# EAGLE design power_backup (EAGLE 6.5.0)
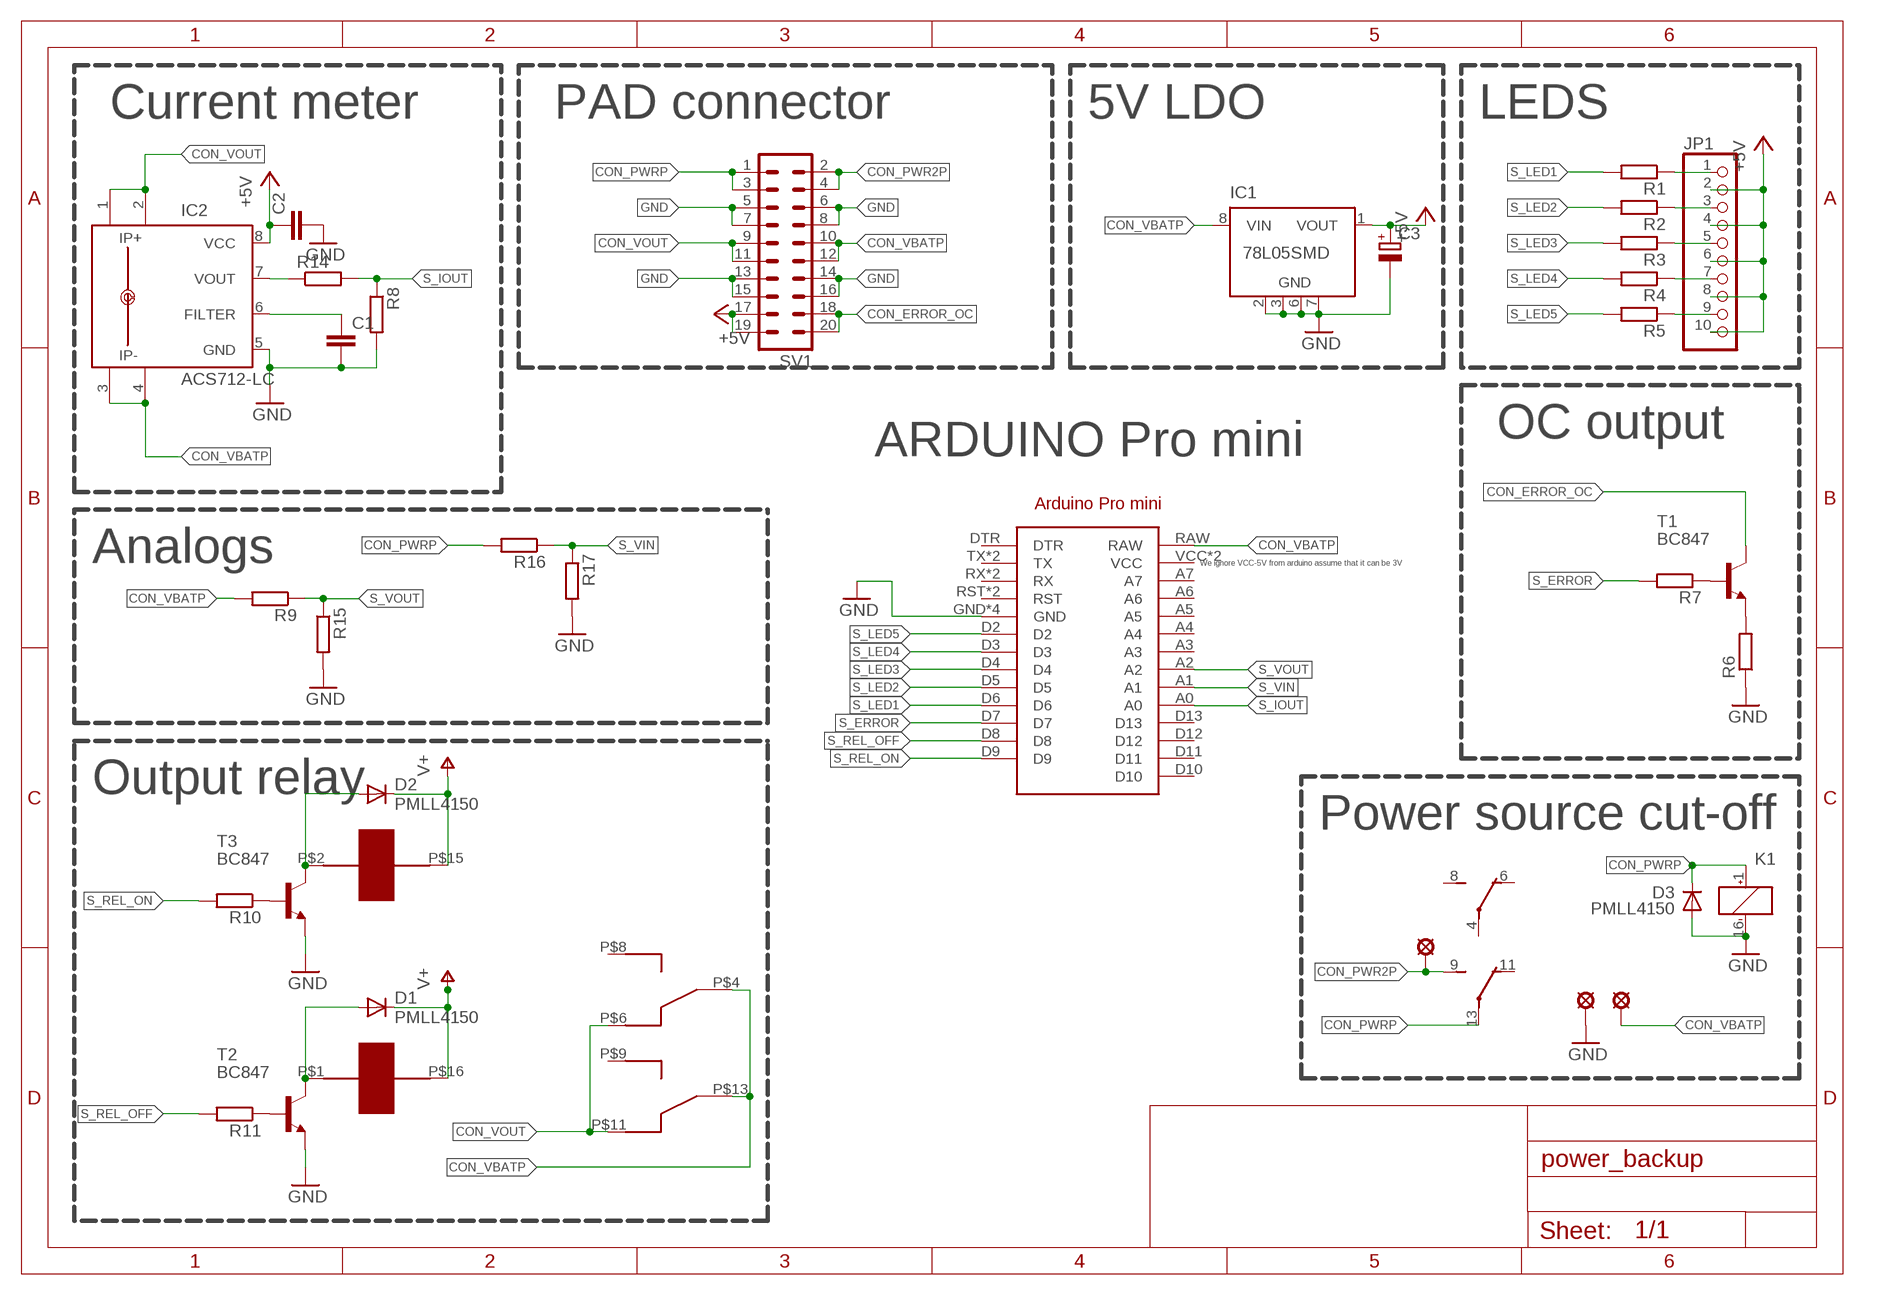
[diagram p0: schematic, sheet 1]

## Parts
ARDUINO1  ARDUINO_PRO_MINI  [ARDUINO_PRO_MINI]
C1  C-EUC0805  [C0805]
C2  C-EUC0805  [C0805]
C3  CPOL-EUSMCC  [SMC_C]
D1  PMLL4150  [SOD80C]
D2  PMLL4150  [SOD80C]
D3  PMLL4150  [SOD80C]
IC1  78L05SMD  [SO08]
IC2  ACS712-LC  [SOIC8]
JP1  PINHD-1X10  [1X10]
K1  DS2Y-S-DC48V  [DS2Y]
LSP1  LSP10  [LSP10]
LSP2  LSP10  [LSP10]
LSP3  LSP10  [LSP10]
R1  R-EU_M0805  [M0805]
R2  R-EU_M0805  [M0805]
R3  R-EU_M0805  [M0805]
R4  R-EU_M0805  [M0805]
R5  R-EU_M0805  [M0805]
R6  R-EU_M0805  [M0805]
R7  R-EU_M0805  [M0805]
R8  R-EU_M0805  [M0805]
R9  R-EU_M0805  [M0805]
R10  R-EU_M0805  [M0805]
R11  R-EU_M0805  [M0805]
R14  R-EU_M0805  [M0805]
R15  R-EU_M0805  [M0805]
R16  R-EU_M0805  [M0805]
R17  R-EU_M0805  [M0805]
SV1  MA10-2  [MA10-2]
T1  BC847  [SOT23]
T2  BC847  [SOT23]
T3  BC847  [SOT23]
U$1  HFD2/003  [RELAY]

## Nets
+5V: C2.1 C3.+ IC1.1(VOUT) IC2.8(VCC) JP1.2 JP1.4 JP1.6 JP1.8 JP1.10 SV1.17 SV1.19
CON_ERROR_OC: SV1.18 SV1.20 T1.3(C)
CON_PWR2P: K1.9(3:S) LSP1.MP SV1.2 SV1.4
CON_PWRP: D3.C K1.1(1:+) K1.13(3:P) R16.2 SV1.1 SV1.3
CON_VBATP: ARDUINO1.RAW IC1.8(VIN) IC2.3(IP-) IC2.4(IP-1) LSP2.MP R9.2 SV1.10 SV1.12 U$1.P$4(MID) U$1.P$13(MID)
CON_VOUT: IC2.1(IP+) IC2.2(IP+1) SV1.9 SV1.11 U$1.P$6(NC) U$1.P$11(NC)
GND: ARDUINO1.GND ARDUINO1.GND@1(GND) ARDUINO1.GND@2(GND) ARDUINO1.GND@3(GND) C1.2 C2.2 C3.- D3.A IC1.2(GND) IC1.3(GND) IC1.6(GND) IC1.7(GND) IC2.5(GND) K1.16(1:-) LSP3.MP R6.1 R8.2 R15.2 R17.2 SV1.5 SV1.6 SV1.7 SV1.8 SV1.13 SV1.14 SV1.15 SV1.16 T2.2(E) T3.2(E)
N$1: JP1.1 R1.1
N$2: JP1.3 R2.1
N$3: JP1.5 R3.1
N$4: JP1.7 R4.1
N$5: JP1.9 R5.1
N$6: D1.A T2.3(C) U$1.P$1
N$7: D2.A T3.3(C) U$1.P$2
N$8: R10.1 T3.1(B)
N$9: R11.1 T2.1(B)
N$12: C1.1 IC2.6(FILTER)
N$13: IC2.7(VOUT) R14.1
N$14: R7.1 T1.1(B)
N$15: R6.2 T1.2(E)
S_ERROR: ARDUINO1.D7 R7.2
S_IOUT: ARDUINO1.A0 R8.1 R14.2
S_LED1: ARDUINO1.D6 R1.2
S_LED2: ARDUINO1.D5 R2.2
S_LED3: ARDUINO1.D4 R3.2
S_LED4: ARDUINO1.D3 R4.2
S_LED5: ARDUINO1.D2 R5.2
S_REL_OFF: ARDUINO1.D8 R11.2
S_REL_ON: ARDUINO1.D9 R10.2
S_VIN: ARDUINO1.A1 R16.1 R17.1
S_VOUT: ARDUINO1.A2 R9.1 R15.1
V+: D1.C D2.C U$1.P$15 U$1.P$16
Unconnected: ARDUINO1.A3 ARDUINO1.A4 ARDUINO1.A5 ARDUINO1.A6 ARDUINO1.A7 ARDUINO1.D10 ARDUINO1.D11 ARDUINO1.D12 ARDUINO1.D13 ARDUINO1.DTR ARDUINO1.RST ARDUINO1.RST@1(RST) ARDUINO1.RX ARDUINO1.RX@1(RX) ARDUINO1.TX ARDUINO1.TX@1(TX) IC1.4(NC) IC1.5(NC) K1.4(2:P) K1.6(2:O) K1.8(2:S) K1.11(3:O) U$1.P$8(NO) U$1.P$9(NO)

## Notes on the sheet
- Current meter | PAD connector | 5V LDO | LEDS
- OC output
- ARDUINO Pro mini
- Analogs | We ignore VCC-5V from arduino assume that it can be 3V
- Output relay
- Power source cut-off

## Power pins joined to a net without a drawn wire
VCC: ARDUINO1.VCC ARDUINO1.VCC@1(VCC)

## Library data of the parts
ARDUINO1 = arduinopromini:ARDUINO_PRO_MINI: For creating Arduino Pro Mini shields
C1 C2 = rcl:C-EU: CAPACITOR, European symbol
C3 = rcl:CPOL-EU: POLARIZED CAPACITOR, European symbol
D1-D3 = diode:PMLL4150: DIODE high speed
IC1 = linear:78L*SMD: Positive VOLTAGE REGULATOR
IC2 = allegro-2:ACS712-LC
JP1 = pinhead:PINHD-1X10: PIN HEADER
K1 = relay:DS2Y-S-DC*: MINIATURE RELAY NAiS Source: http://www.mew-europe.com/.. en_ds_61005_0023.pdf; MPN: DS2Y-S-DC48V; OC_FARNELL: unknown; OC_NEWARK: 13P3267
LSP1-LSP3 = solpad:LSP10: SOLDER PAD drill 1.0 mm, distributor Buerklin, 12H555
R1-R11 R14-R17 = rcl:R-EU_: RESISTOR, European symbol
SV1 = con-lstb:MA10-2: PIN HEADER; OC_FARNELL: unknown; OC_NEWARK: unknown
T1-T3 = transistor:BC847: NPN TRANSISTOR
U$1 = relay_hfd2:HFD2/003

## Board
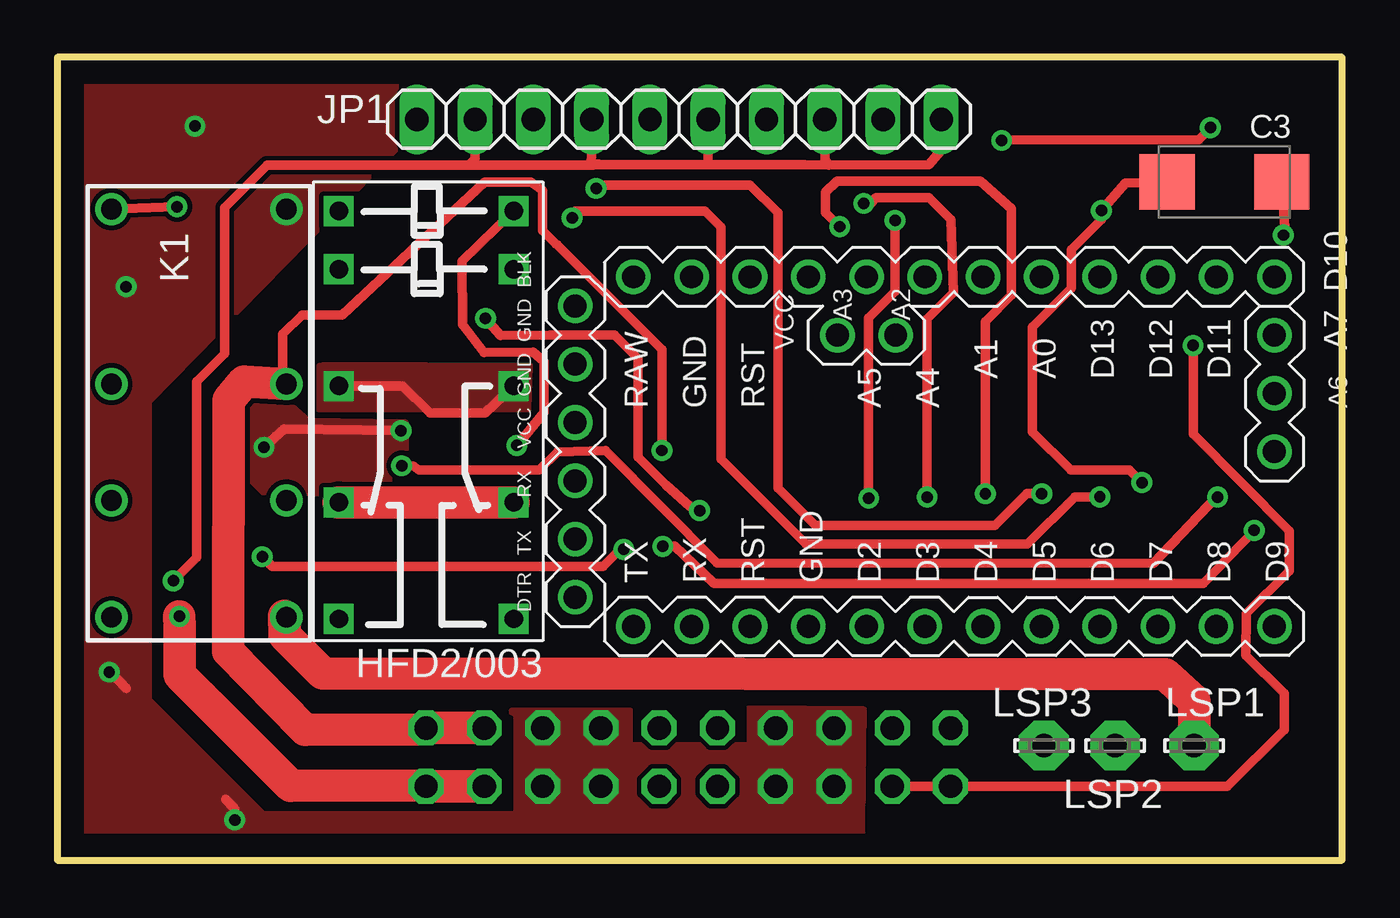
[diagram p1: board, top side]
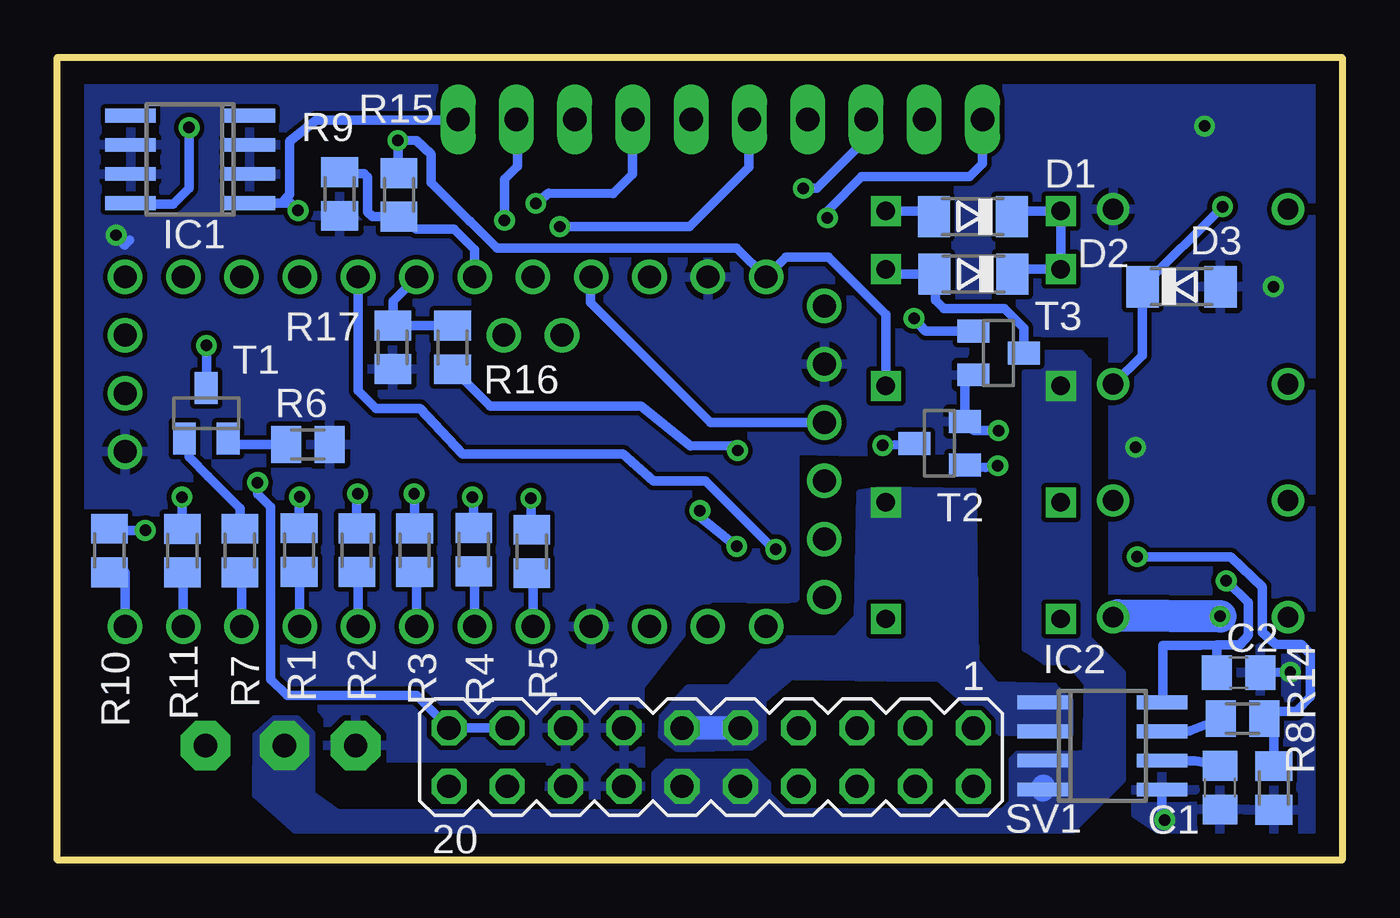
[diagram p2: board, bottom side, seen from below]

Size 56 x 35 mm. Coordinates in mm from the lower left corner, seen from the top.
Outline: 0,0 56,0 56,35 0,35 0,0
Copper layers (1*16): Top 0.035mm / dielectric 1.5mm / Bottom 0.035mm
Design rules "default": minimum track width 10mil, minimum drill 24mil, track to track 8mil, track to pad 8mil, pad to pad 8mil, via to via 8mil, smd to smd 8mil, copper to edge 40mil, drill to drill 8mil, minimum pad ring 10mil, minimum via ring 8mil, stop-mask expansion 4mil, vias tented up to drill 0mil, thermal gap 10mil

### Footprints (pad centres in the part's own frame; a part is rotated, then mirrored left to right if it is on the bottom)
ARDUINO_PRO_MINI = drill 1: A0 11.43,-8.89; A1 11.43,-6.35; A2 11.43,-3.81; A3 11.43,-1.27; A4 8.89,-2.54; A5 8.89,0; A6 6.35,-19.05; A7 8.89,-19.05; BLK 10.16,11.43; D2 -3.81,-1.27; D3 -3.81,-3.81; D4 -3.81,-6.35; D5 -3.81,-8.89; D6 -3.81,-11.43; D7 -3.81,-13.97; D8 -3.81,-16.51; D9 -3.81,-19.05; D10 11.43,-19.05; D11 11.43,-16.51; D12 11.43,-13.97; D13 11.43,-11.43; DTR -2.54,11.43; GND -3.81,1.27; GND@1 11.43,6.35; GND@2 7.62,11.43; GND@3 3.81,-19.05; RAW 11.43,8.89; RST 11.43,3.81; RST@1 -3.81,3.81; RX -3.81,6.35; RX@1 2.54,11.43; TX -3.81,8.89; TX@1 0,11.43; VCC 11.43,1.27; VCC@1 5.08,11.43
C0805 = smd 1.3 x 1.5: 1 -0.95,0; 2 0.95,0
SMC_C = smd 2.4 x 2.4: + -2.5,0; - 2.5,0
SOD80C = smd 1.4 x 1.8: A 1.7,0; C -1.7,0
SO08 = smd 0.6 x 2.2: 1 -1.905,-2.6; 2 -0.635,-2.6; 3 0.635,-2.6; 4 1.905,-2.6; 5 1.905,2.6; 6 0.635,2.6; 7 -0.635,2.6; 8 -1.905,2.6
SOIC8 = smd 0.6 x 2.2: 1 -1.905,-2.6; 2 -0.635,-2.6; 3 0.635,-2.6; 4 1.905,-2.6; 5 1.905,2.6; 6 0.635,2.6; 7 -0.635,2.6; 8 -1.905,2.6
1X10 = drill 1.016 long: 1 -11.43,0; 2 -8.89,0; 3 -6.35,0; 4 -3.81,0; 5 -1.27,0; 6 1.27,0; 7 3.81,0; 8 6.35,0; 9 8.89,0; 10 11.43,0
DS2Y = drill 0.9: 1 -8.89,-3.81; 4 -1.27,-3.81; 6 3.81,-3.81; 8 8.89,-3.81; 9 8.89,3.81; 11 3.81,3.81; 13 -1.27,3.81; 16 -8.89,3.81
LSP10 = drill 1.016 pad 2.159 octagon: MP 0,0
M0805 = smd 1.3 x 1.6: 1 -0.95,0; 2 0.95,0
MA10-2 = drill 1.016 octagon: 1 -11.43,-1.27; 2 -11.43,1.27; 3 -8.89,-1.27; 4 -8.89,1.27; 5 -6.35,-1.27; 6 -6.35,1.27; 7 -3.81,-1.27; 8 -3.81,1.27; 9 -1.27,-1.27; 10 -1.27,1.27; 11 1.27,-1.27; 12 1.27,1.27; 13 3.81,-1.27; 14 3.81,1.27; 15 6.35,-1.27; 16 6.35,1.27; 17 8.89,-1.27; 18 8.89,1.27; 19 11.43,-1.27; 20 11.43,1.27
SOT23 = smd 1 x 1.4: 1 -0.95,-1.1; 2 0.95,-1.1; 3 0,1.1
RELAY = drill 0.8 square: P$1 1.27,1.27; P$2 1.27,3.81; P$4 1.27,8.89; P$6 1.27,13.97; P$8 1.27,19.05; P$9 8.89,19.05; P$11 8.89,13.97; P$13 8.89,8.89; P$15 8.89,3.81; P$16 8.89,1.27

### Placement (x,y rotation side)
ARDUINO1  34,14 90 top
C1  5.33,3.16 270 bottom
C2  4.52,8.18 0 bottom
C3  50.87,29.57 0 top
D1  16.1,28.06 180 bottom
D2  16.07,25.55 180 bottom
D3  7,25 0 bottom
IC1  50.21,30.55 90 bottom
IC2  10.45,4.98 270 bottom
JP1  27.1,32.3 0 top
K1  6.17,19.49 270 top
LSP1  49.55,5 0 top
LSP2  46.1,5 0 top
LSP3  43,5 0 top
R1  45.46,13.52 270 bottom
R2  42.95,13.51 270 bottom
R3  40.43,13.51 270 bottom
R4  37.85,13.54 270 bottom
R5  35.32,13.46 270 bottom
R6  45.08,18.12 180 bottom
R7  48.04,13.5 270 bottom
R8  2.98,3.15 270 bottom
R9  41.11,29 90 bottom
R10  53.73,13.5 270 bottom
R11  50.55,13.49 270 bottom
R14  4.34,6.17 0 bottom
R15  43.7,29.04 270 bottom
R16  38.77,22.35 270 bottom
R17  41.38,22.36 270 bottom
SV1  27.5,4.49 180 bottom
T1  49.51,19.48 0 bottom
T2  17.55,18.17 90 bottom
T3  14.98,22.11 270 bottom
U$1  21.16,29.57 180 top

### Tracks (layer width: path | path; a pad name or v marks a point on that pad's centre or on a via)
+5V  (via drill 0.5)
  Top 0.406: 24,30.32 23.26,30.36 23.29,30.82 JP1.4 | 24,30.32 28.34,30.33 | 28.34,30.33 32.58,30.32 33.63,30.31 | 33.63,30.31 37.98,30.32 38.5,30.91 38.5,32.27 JP1.10 | JP1.8 33.45,30.57 33.63,30.31 | JP1.6 28.37,30.72 28.34,30.33 | 17.93,30.3 23.36,30.31 24,30.32 | JP1.2 18.21,30.58 17.93,30.3 | 17.93,30.3 9.15,30.3 7.3,28.45 7.3,22.09 6.07,20.86 6.07,13.2 v5.05,12.18 5.01,12.18 | v47.27,16.46 46.73,17 44.17,17 42.5,18.67 42.5,23.24 44.19,24.93 44.19,26.61 45.51,27.93 v45.51,28.32 46.54,29.52 C3.+
  Bottom 0.406: 5.47,9.38 6.19,9.37 7.8,9.37 7.8,7.06 7.85,7.01 IC2.8 | 5.47,9.38 4.46,9.39 4.1,9.8 4.1,11.23 v5.05,12.18 | IC1.1 46.22,28.64 | 46.22,28.64 45.87,29.01 45.87,31.35 44.73,32.26 38.57,32.26 JP1.10 | SV1.17 SV1.19 40.35,7.18 45.99,7.18 46.7,7.89 46.7,15.4 47.27,15.97 v47.27,16.46 | 46.22,28.64 45.84,28.64 v45.51,28.32 | C2.1 5.47,9.38
CON_ERROR_OC  (via drill 0.5)
  Top 0.406: SV1.18 SV1.20 51,3.22 53.47,5.69 53.47,7.27 51.81,8.93 51.82,10.75 53.69,12.62 53.69,14.35 49.52,18.59 49.52,22.42 v49.5,22.44
  Bottom 0.406: v49.5,22.44 T1.3
CON_PWR2P  (via drill 0.5)
  Top 0.406: 10.16,3.25 13.43,3.25
  Top 1.422: SV1.4 SV1.2 16.02,3.27 10.16,3.25 5.33,8.08 5.33,10.21 v5.32,10.63 | LSP1.MP 49.55,6.94 48.3,8.11 11.56,8.15 9.9,9.8 9.88,10.65 K1.9
  Bottom 1.422: v5.32,10.63 9.78,10.67 K1.9
CON_PWRP  (via drill 0.5)
  Top 0.406: v26.35,17.86 26.35,22.27 21.78,26.84 21.74,26.86 21.15,27.45 21.15,29.18 20.65,29.56 18.62,29.56 12.41,23.77 10.67,23.77 9.83,22.93 9.83,20.88 K1.13 | K1.1 v5.21,28.49
  Top 1.016: 18.68,5.83 SV1.3
  Top 1.422: K1.13 8.15,20.87 7.46,20.05 7.45,9.1 10.81,5.69 16.01,5.7 SV1.1 SV1.3
  Bottom 0.406: R16.2 38.73,21.4 37.14,19.81 30.57,19.81 28.4,18.05 26.55,18.07 v26.35,17.86 | K1.13 8.7,21.99 D3.C v5.21,28.49
CON_VBATP  (via drill 0.5)
  Top 0.406: U$1.P$13 15.05,20.68 16.24,19.49 18.64,19.49 U$1.P$4 | v41.16,31.38 49.76,31.41 v50.26,31.94
  Bottom 0.406: U$1.P$4 19.89,23.79 22.39,26.29 24.24,26.3 ARDUINO1.RAW 26.4,26.69 36.83,26.69 38,27.86 38.03,27.86 39.7,29.53 39.7,30.79 40.34,31.36 v41.16,31.38 41.17,31.29 R9.2 41.17,30.05 | 51.95,28.66 IC1.8 52.77,28.6 50.96,28.6 50.26,29.3 v50.26,31.94
  Bottom 1.016: 13.03,3.23 IC2.4
  pour Top (no thermals): 11.42,21.55 11.4,19.66 20.54,19.66 20.61,21.55 11.67,21.58
  pour Bottom (no thermals): 11.07,21.8 11.07,9.7 9.56,8.19 9.56,3.49 12.22,0.83 44.91,0.63 47.38,2.82 47.36,5.47 46.52,6.2 45.55,6.2 44.9,5.56 44.9,2.91 43.77,2.12 30.34,2.12 29.97,2.43 29.97,3.81 29.42,4.31 25.95,4.3 25.02,3.37 25.02,2.89 24.28,2.15 14.79,2.15 14.4,2.54 14.4,4.4 14.13,4.66 11.79,4.66 11.19,4.71 11.13,7.69 11.93,8.63 12.94,8.61 13.83,9.21 13.83,21.28 12.99,22.12 11.38,22.12 11.03,21.77
CON_VOUT
  Top 1.422: U$1.P$11 U$1.P$6
  Bottom 1.016: SV1.11 SV1.9
  pour Bottom (no thermals): 16.05,16.1 20.13,16.17 21.06,16.03 21.17,10.61 22.07,9.66 24.77,9.67 26.72,7.54 28.53,7.53 29.67,6.25 29.71,5.42 28.96,4.84 25.73,4.92 25.2,5.33 25.2,6.99 24,8 19.85,7.92 17.63,7.93 14.92,5.56 11.83,5.5 11.82,6.93 12.54,7.61 15.1,7.67 15.95,8.69
GND  (via drill 0.5)
  Top 0.406: v9,18 9.88,18.79 v14.98,18.73 | C3.- 53.5,27.57 v53.44,27.25 | v7.73,1.76 7.73,2.25 7.33,2.65 | v2.26,8.2 2.33,8.2 3.01,7.49
  Bottom 0.406: v14.98,18.73 16.06,18.73 T2.2 16.45,20.79 T3.2 | v53.44,27.25 53.06,26.82 52.84,27.04 | IC2.5 7.85,1.88 v7.73,1.76 | C2.2 2.16,8.21 v2.26,8.2
  other vias: 3,25 6,32
  pour Bottom: 0,35 56,35 56.35,-0.49 48.39,-0.39 48.29,5.63 48.29,6.09 47.35,7.03 44.89,7.01 44.2,6.26 44.23,4.45 34.51,4.47 34.56,2.85 30.58,2.82 30.6,7.57 27.57,11.44 24.32,11.39 23.86,11.43 23.86,17.87 18.02,17.74 17,18 17,21 16,23 10,23 10,11 6,8 9,5 9,2 6,0 0,0
  pour Top (no thermals): 19.79,6.45 arc-90 20,6.24 20,2 9,2 4,7 4,20 14.77,31 14.77,34.93 -0.23,34.93 -0.31,-0.11 35.06,-0.01 35.16,6.57 30.16,6.62 30.16,5.01 24.97,5.01 24.97,6.51 19.81,6.51
  pour Top: 8,20 10,20 10.94,19.16 15.17,19.1 15.17,15.9 9,16 8,17
N$1  (via drill 0.5)
  Top 0.406: v45.44,15.84 44.35,15.84 42.29,13.78 32.63,13.78 28.93,17.48 28.93,27.6 28.23,28.3 22.57,28.3 22.27,28 v22.44,28
  Bottom 0.406: R1.1 45.46,15.82 v45.44,15.84 | JP1.1 15.67,30.36 16.24,29.79 20.96,29.79 22.38,28.34 22.39,27.91 v22.44,28
N$2  (via drill 0.5)
  Top 0.406: v42.91,15.98 42.25,15.98 40.86,14.59 33.04,14.59 31.41,16.22 31.41,28.22 30.2,29.43 23.62,29.43 v23.48,29.29
  Bottom 0.406: R2.1 42.95,15.94 v42.91,15.98 | v23.48,29.29 22.89,29.29 20.82,31.36 20.82,32.23 JP1.3
N$3  (via drill 0.5)
  Top 0.406: v40.45,15.98 40.45,23.49 41.59,24.63 41.59,28.41 40.23,29.61 33.98,29.61 33.48,29.13 33.48,28.24 v34.1,27.62
  Bottom 0.406: R3.1 40.43,15.96 v40.45,15.98 | v34.1,27.62 28.44,27.62 25.85,30.21 25.85,32.28 JP1.5
N$4  (via drill 0.5)
  Top 0.406: v37.91,15.83 37.91,23.6 39.06,24.75 38.94,27.92 37.98,28.88 35.69,28.89 35.43,28.63 v35.15,28.63
  Bottom 0.406: R4.1 37.85,15.77 v37.91,15.83 | v35.15,28.63 34.58,29.08 31.78,29.06 30.94,29.9 30.94,32.27 JP1.7
N$5  (via drill 0.5)
  Top 0.406: v35.36,15.78 35.36,23.64 36.51,24.79 v36.51,27.89
  Bottom 0.406: R5.1 35.36,14.41 v35.36,15.78 | v36.51,27.89 36.51,29.68 35.94,30.25 35.94,32.25 JP1.9
N$6  (via drill 0.5)
  Top 0.406: U$1.P$1 17.64,26.11 17.66,23.36 18.6,22.13 20.74,22.15 21.21,21.73 21.22,19.51 v20.03,18.08
  Bottom 0.406: U$1.P$1 18.04,28.3 D1.A | v20.03,18.08 19.09,18.12 T2.3
N$7
  Bottom 0.406: U$1.P$2 19.62,25.55 D2.A 17.73,25.51 17.73,24.42 17.35,24.04 14.73,24.04 13.88,23.19 T3.3
N$8  (via drill 0.5)
  Top 0.406: v18.66,23.62 19.32,22.87 21.45,22.89 24.29,22.89 25.31,21.87 25.31,17.57 26.52,16.36 27.58,15.41 v27.99,15.24 | v26.39,13.68 26.89,13.69 28.62,12.07 49.95,12.07 v52.17,14.38
  Bottom 0.406: 18.42,23.56 v18.66,23.62 18.17,23.06 T3.1 | 53.03,14.42 R10.1 53.66,14.38 v52.17,14.38 | v27.99,15.24 28,14.97 v26.39,13.68
N$9  (via drill 0.5)
  Top 0.406: v50.57,15.83 50.56,15.88 47.76,12.94 28.76,12.95 23.89,17.86 21.8,17.8 21,17 15.76,17 15.51,17.19 v15.01,17.2
  Bottom 0.406: R11.1 50.55,15.81 v50.57,15.83 | v15.01,17.2 15.56,17.13 16.38,17.15 T2.1
N$12
  Bottom 0.406: C1.1 6.27,4.31 6.4,4.33 7.82,4.33 IC2.6
N$13
  Bottom 0.406: 7.83,5.73 IC2.7 6.64,5.63 R14.1
N$14
  Bottom 0.406: R7.1 48.04,15.34 49.42,16.72 49.42,16.73 50.26,17.57 50.26,18.18 T1.1
N$15
  Bottom 0.406: R6.2 48.3,18.12 T1.2
S_ERROR
  Bottom 0.406: ARDUINO1.D7 47.97,12.48 R7.2
S_IOUT  (via drill 0.5)
  Top 0.406: v24.69,13.55 24.53,13.55 23.78,12.8 9.36,12.8 v8.93,13.23
  Bottom 0.406: R8.1 2.98,6.08 | 2.98,6.08 2.95,6.49 | 2.95,6.49 R14.2 | 3,6.29 2.98,6.08 | ARDUINO1.A0 42.89,20.48 42.11,19.7 40.19,19.7 38.34,17.7 31.34,17.7 30.02,16.53 27.75,16.53 24.77,13.55 v24.69,13.55 | v8.93,13.23 4.85,13.23 3.49,11.91 3.49,9.93 2.89,9.4 1.79,9.4 1.38,8.99 1.38,7.11 2,6.49 2.95,6.49
S_LED1
  Bottom 0.406: ARDUINO1.D6 45.43,12.54 R1.2
S_LED2
  Bottom 0.406: ARDUINO1.D5 42.89,12.5 R2.2
S_LED3
  Bottom 0.406: ARDUINO1.D4 40.35,12.48 R3.2
S_LED4
  Bottom 0.406: ARDUINO1.D3 37.81,12.55 R4.2
S_LED5
  Bottom 0.406: ARDUINO1.D2 35.27,12.46 R5.2
S_REL_OFF
  Bottom 0.406: ARDUINO1.D8 50.51,12.5 R11.2
S_REL_ON
  Bottom 0.406: ARDUINO1.D9 53.05,12.54 R10.2
S_VIN
  Bottom 0.406: ARDUINO1.A1 40.35,25.4 41.37,24.38 R17.1 R16.1
S_VOUT
  Bottom 0.406: ARDUINO1.A2 37.81,26.62 38.7,27.51 40.36,27.51 40.94,27.97 41.29,27.89 R9.1 | R9.1 41.02,28.03 | R9.1 42.26,28.05 42.47,28.26 42.47,29.77 42.63,29.93 43.64,29.93 R15.1
V+
  Bottom 0.406: D1.C 14.16,28.3 U$1.P$16 U$1.P$15 14.16,25.76 D2.C
VCC
  Bottom 0.406: ARDUINO1.VCC@1 27.53,19.08 32.76,24.31 32.76,25.4 ARDUINO1.VCC